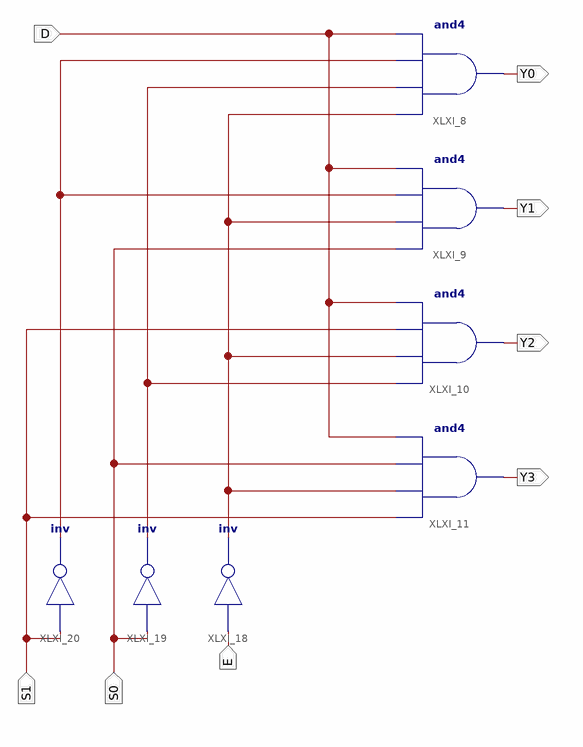
[diagram p0: schematic sheet 1]
// Xilinx ISE schematic demux1to4.sch (spartan3e) as structural Verilog: 7 symbols, 8 ports
module demux1to4 (
  input  D,
  input  S0,
  input  S1,
  input  E,
  output Y3,
  output Y2,
  output Y0,
  output Y1
);

  wire XLXN_17, XLXN_18, XLXN_19;

  and XLXI_8 (Y0, XLXN_17, XLXN_18, XLXN_19, D);
  and XLXI_9 (Y1, S0, XLXN_17, XLXN_19, D);
  and XLXI_10 (Y2, XLXN_18, XLXN_17, S1, D);
  and XLXI_11 (Y3, S1, XLXN_17, S0, D);
  not XLXI_18 (XLXN_17, E);
  not XLXI_19 (XLXN_18, S0);
  not XLXI_20 (XLXN_19, S1);
endmodule
